# EasyEDA Pro project ProPrj_工创赛_2026-09-08.epro, schematic Schematic1

## Sheets
1 Power: Assembly Variant: Basic; Board Name: Board1; Create Date: 2026-08-24; Page Name: P1; Project Name: 工创赛; Schematic Name: Schematic1; Update Date: 2026-08-24; Company: 嘉立创EDA; Page Size: A4; Version: V1.0
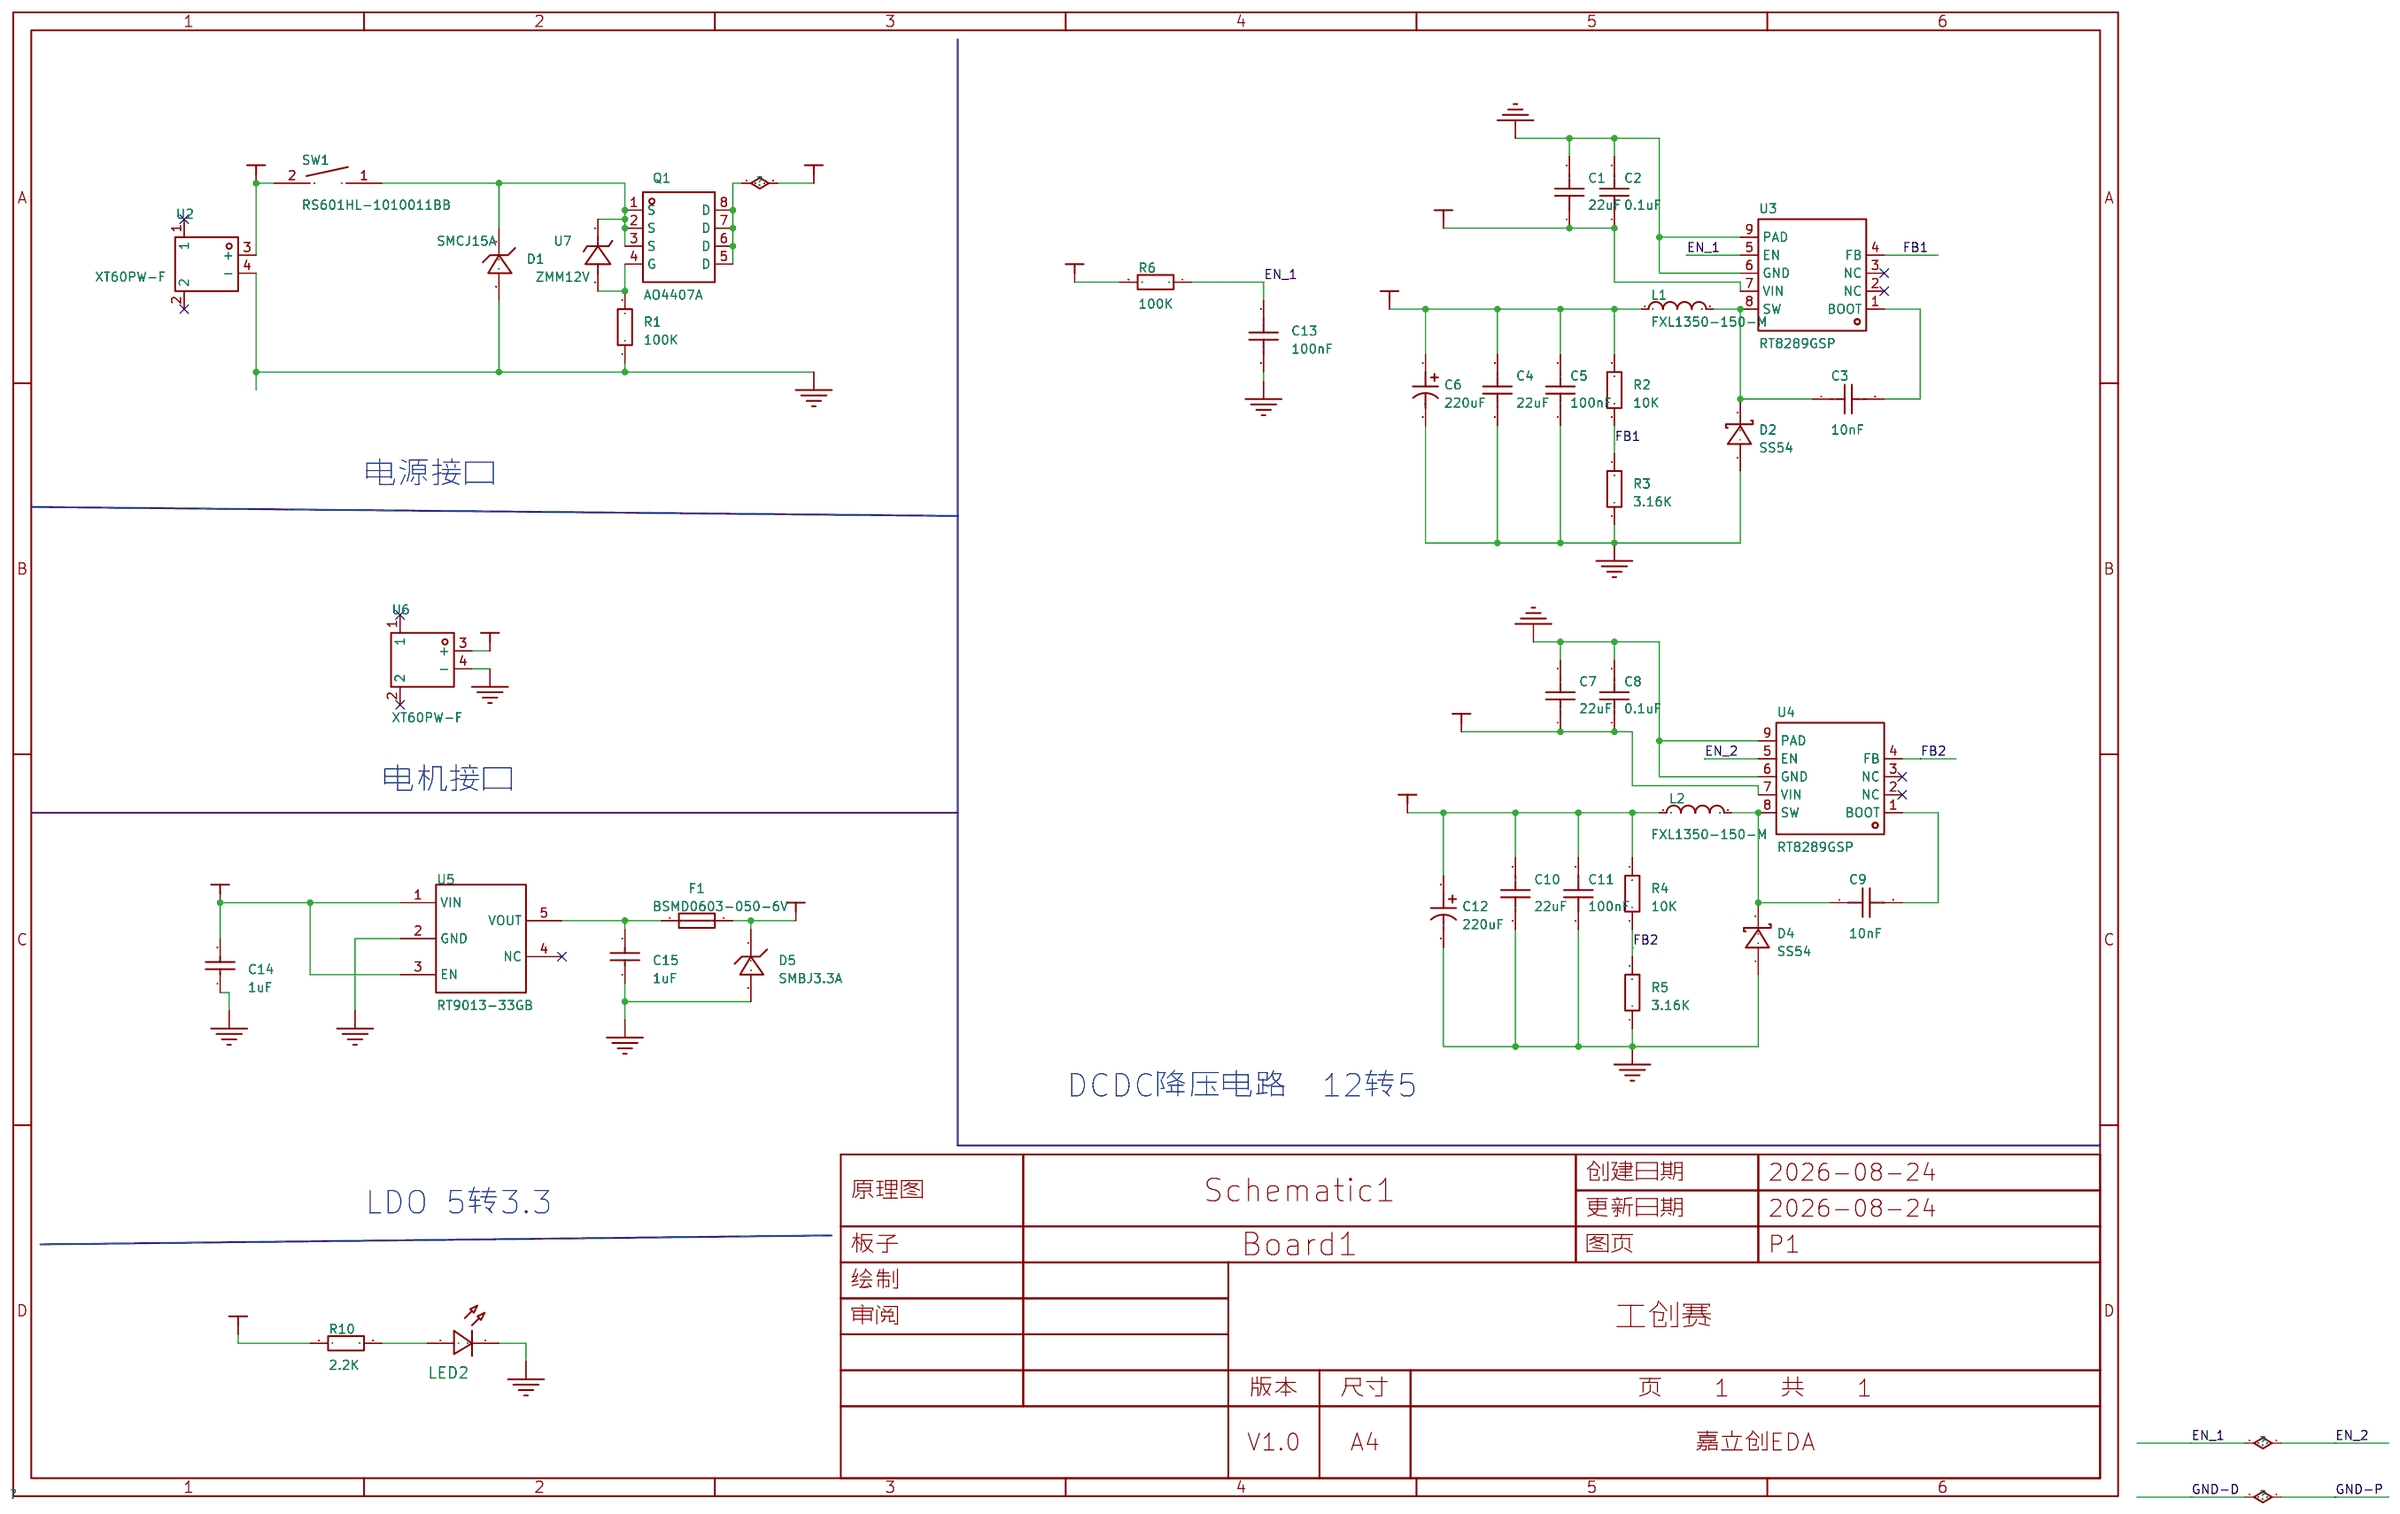
[diagram p0: Power]
2 MCU: Create Date: 2026-08-26; Update Date: 2026-08-26
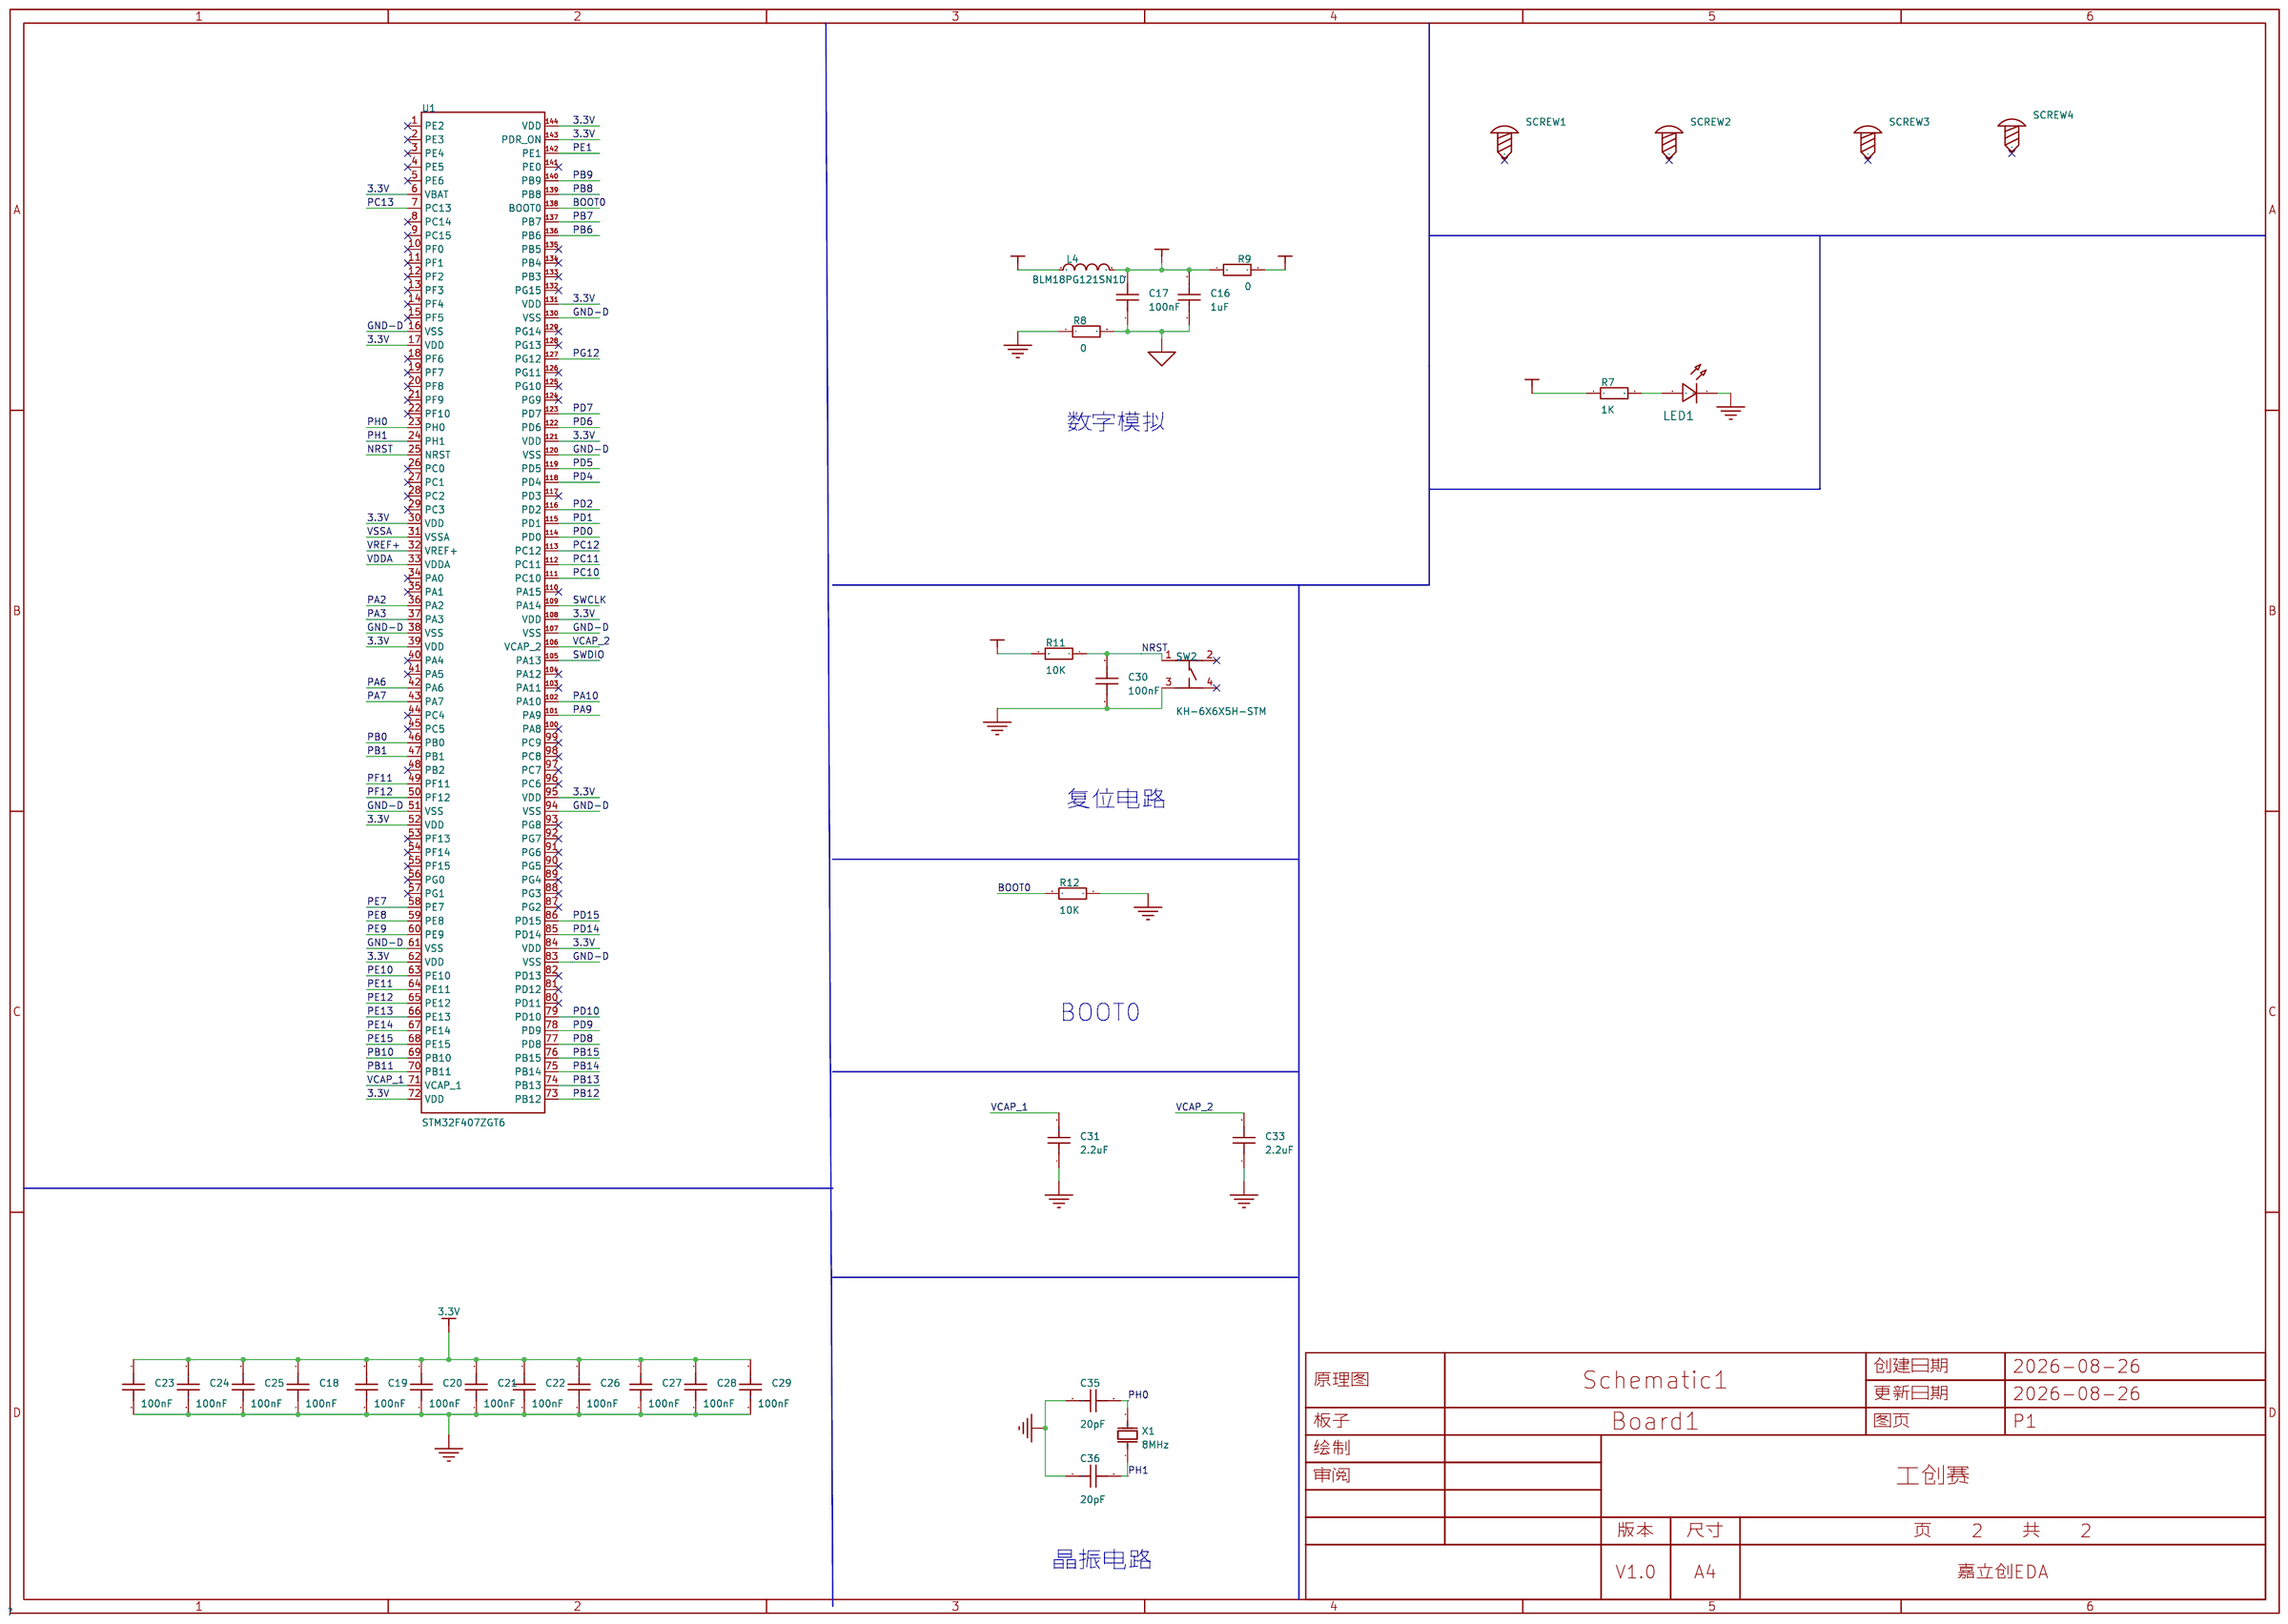
[diagram p1: MCU]
3 Single: Create Date: 2026-09-01; Update Date: 2026-09-01
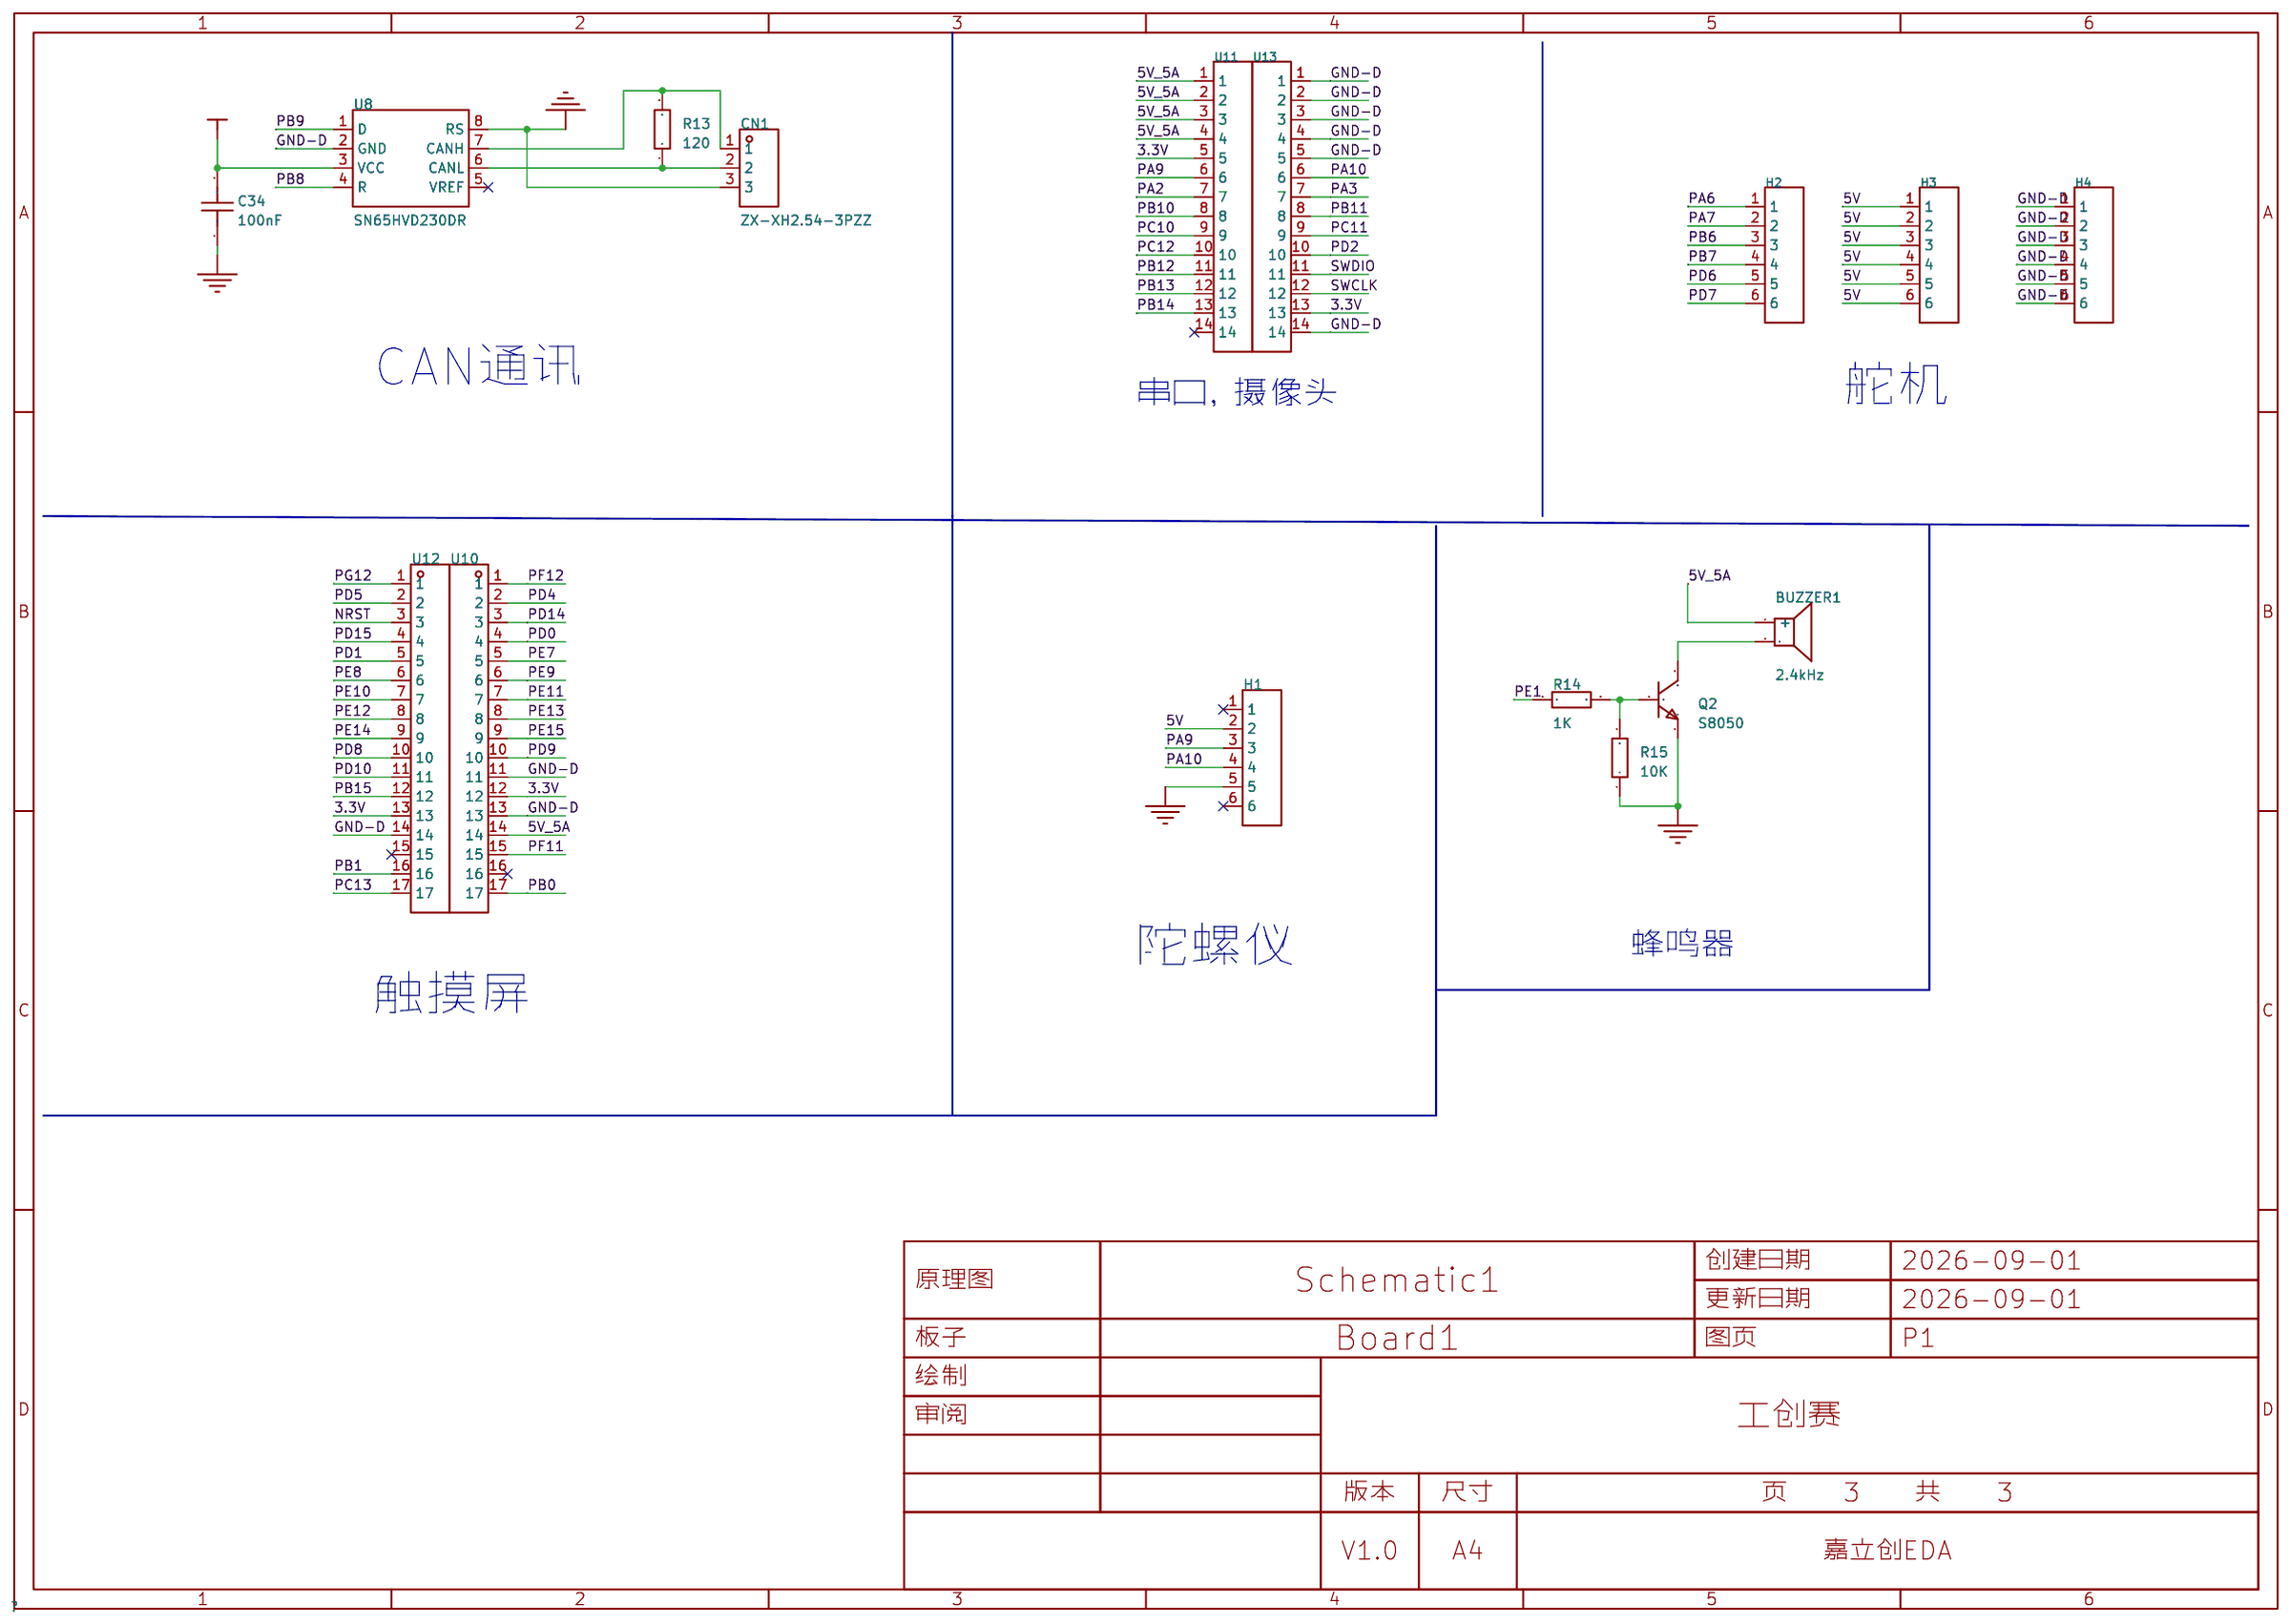
[diagram p2: Single]

## Parts
sheet MCU
C16  1uF  [C0603]
C17  100nF  [C0603]
C18  100nF  [C0603]
C19  100nF  [C0603]
C20  100nF  [C0603]
C21  100nF  [C0603]
C22  100nF  [C0603]
C23  100nF  [C0603]
C24  100nF  [C0603]
C25  100nF  [C0603]
C26  100nF  [C0603]
C27  100nF  [C0603]
C28  100nF  [C0603]
C29  100nF  [C0603]
C30  100nF  [C0603]
C31  2.2uF  [C0603]
C33  2.2uF  [C0603]
C35  20pF  [C0603]
C36  20pF  [C0603]
L4  BLM18PG121SN1D  [L0603]
LED1  -  [LED_0603]
R7  1K  [R0603]
R8  0  [R0603]
R9  0  [R0603]
R11  10K  [R0603]
R12  10K  [R0603]
SCREW1  -  [M3螺丝]
SCREW2  -  [M3螺丝]
SCREW3  -  [M3螺丝]
SCREW4  -  [M3螺丝]
SW2  KH-6X6X5H-STM  [SW-SMD_4P-L6.0-W6.0-P4.50-LS9.0_H5.0]
U1  STM32F407ZGT6  [LQFP-144_L20.0-W20.0-P0.50-LS22.0-BL]
X1  8MHz  [OSC-SMD_L5.0-W3.2]
sheet Power
C1  22uF  [C0603]
C2  0.1uF  [C0603]
C3  10nF  [C0603]
C4  22uF  [C0603]
C5  100nF  [C0603]
C6  220uF  [CAP-SMD_BD6.3-L6.6-W6.6-FD]
C7  22uF  [C0603]
C8  0.1uF  [C0603]
C9  10nF  [C0603]
C10  22uF  [C0603]
C11  100nF  [C0603]
C12  220uF  [CAP-SMD_BD6.3-L6.6-W6.6-FD]
C13  100nF  [C0603]
C14  1uF  [C0603]
C15  1uF  [C0603]
D1  SMCJ15A  [SMC_L6.9-W5.9-LS8.0-RD]
D2  SS54  [SMA_L4.4-W2.8-LS5.4-R-RD]
D4  SS54  [SMA_L4.4-W2.8-LS5.4-R-RD]
D5  SMBJ3.3A  [SMB_L4.6-W3.6-LS5.3-RD]
F1  BSMD0603-050-6V  [F0603]
L1  FXL1350-150-M  [IND-SMD_L12.6-W13.5]
L2  FXL1350-150-M  [IND-SMD_L12.6-W13.5]
LED2  -  [LED_0603]
Q1  AO4407A  [SOP-8_L5.0-W4.0-P1.27-LS6.0-BL]
R1  100K  [R0603]
R2  10K  [R0603]
R3  3.16K  [R0603]
R4  10K  [R0603]
R5  3.16K  [R0603]
R6  100K  [R0603]
R10  2.2K  [R0603]
SW1  RS601HL-1010011BB  [SW-TH_RS601HL-1010011BB]
U2  XT60PW-F  [TH_2P-XT60PW-F]
U3  RT8289GSP  [SOIC-8_L5.0-W4.0-P1.27-LS6.0-BL-EP2.0]
U4  RT8289GSP  [SOIC-8_L5.0-W4.0-P1.27-LS6.0-BL-EP2.0]
U5  RT9013-33GB  [SOT-23-5_L3.0-W1.7-P0.95-LS2.8-BL]
U6  XT60PW-F  [TH_2P-XT60PW-F]
U7  ZMM12V  [LL-34_L3.5-W1.5-RD-2]
sheet Single
BUZZER1  2.4kHz  [BUZ-TH_BD12.0-P7.60-D0.6-FD]
C34  100nF  [C0603]
CN1  ZX-XH2.54-3PZZ  [CONN-TH_3P-P2.54_2501S-3P]
H1  陀螺仪  [HDR-TH_PZ2.54-1X6PZZ-L11.5]
H2  LAIL-PZ2.54-6P-L  [CONN-TH_LAIL-PZ2.54-6P-L]
H3  LAIL-PZ2.54-6P-L  [CONN-TH_LAIL-PZ2.54-6P-L]
H4  LAIL-PZ2.54-6P-L  [CONN-TH_LAIL-PZ2.54-6P-L]
Q2  S8050  [SOT-23-3_L2.9-W1.3-P1.90-LS2.3-BR]
R13  120  [R0603]
R14  1K  [R0603]
R15  10K  [R0603]
U8  SN65HVD230DR  [SOIC-8_L4.9-W3.9-P1.27-LS6.0-BL]
U10  PM254-1-17-Z-8.5  [HDR-TH_17P-P2.54-V-F]
U11  LAIL-PM2.54-14P-L  [HDR-TH_LAIL-PM2.54-14P-L]
U12  触摸屏  [HDR-TH_17P-P2.54-V-F]
U13  LAIL-PM2.54-14P-L  [HDR-TH_LAIL-PM2.54-14P-L]

## Library data of the parts
C1-C5 C7-C11 C13 C16 C17 C30 C31 C33-C36 = CAP_0603: Supplier Footprint: 0603
C18-C29 = CC0603KRX7R9BB104: 容值:100nF;精度:±10%;额定电压:50V;材质(温度系数):X7R;; LCSC Part Name: 100nF ±10% 50V; Supplier Part: C14663; Manufacturer: YAGEO(国巨); Supplier Footprint: 0603; JLCPCB Part Class: 基础库; Datasheet: https://atta.szlcsc.com/upload/public/pdf/source/20180910/C282072_33301C7F631E79921B82A8DAC6BCC5B3.pdf; Supplier: LCSC; Tolerance: ±10%; Voltage Rated: 50V; Temperature Coefficient: X7R
L4 = BLM18PG121SN1D: 阻抗@频率:120Ω@100MHz;误差:±25%;直流电阻(DCR):50mΩ;; LCSC Part Name: 单路 0603磁珠 阻抗120Ω@100MHz; Supplier Part: C14709; Manufacturer: muRata(村田); Supplier Footprint: 0603; JLCPCB Part Class: Basic Part; Datasheet: https://item.szlcsc.com/datasheet/BLM18PG121SN1D/15379.html; Supplier: LCSC; Impedance @ Frequency: 120Ω@100MHz; Tolerance: ±25%; DC Resistance(DCR): 50mΩ; Current Rating: 2A; Number of Circuits: 1; Operating Temperature: -55℃~+125℃
LED1 LED2 = LED_0603-R: Supplier Footprint: 0603
R1-R15 = Res_0603: Supplier Footprint: 0603
SCREW1-SCREW4 = M3螺丝: Supplier Footprint: 插件
SW2 = KH-6X6X5H-STM: 电路结构:单刀单掷;按钮形状:圆形按钮;安装方式:立贴;开关长度:6mm;开关宽度:6mm;开关高度:5mm;带支架:不带支架;触点电流:50mA;额定电压:12V;工作寿命:8万次;; LCSC Part Name: 6*6*5mm 立贴 轻触开关; Supplier Part: C2837531; Manufacturer: kinghelm(金航标); Supplier Footprint: SMD-4P,6x6mm; JLCPCB Part Class: Extended Part; Datasheet: https://item.szlcsc.com/datasheet/KH-6X6X5H-STM/3009601.html; Supplier: LCSC; Circuit: 单刀单掷; Actuator Style: 圆形按钮; Mounting Type: 立贴; Length: 6mm; Width: 6mm; Switch Height: 5mm; with Bracket: 不带支架; Contact Current: 50mA; Voltage Rating: 12V; Actuator/Cap Color: 黑色; Termination Style: 鸥翼型; Life: 8万次
U1 = STM32F407ZGT6: CPU内核:ARM Cortex-M4;CPU最大主频:168MHz;CPU位数:32 Bit;; LCSC Part Name: 带DSP和FPU的高性能基础系列ARM Cortex-M4 MCU，具有1 MB Flash、168 MHz CPU、ART加速器、以太网和FSMC; Supplier Part: C19156; Manufacturer: ST(意法半导体); Supplier Footprint: LQFP-144(20x20); JLCPCB Part Class: Extended Part; Datasheet: https://item.szlcsc.com/datasheet/STM32F407ZGT6/19860.html; Supplier: LCSC; CPU Core: ARM Cortex-M4; CPU Maximum Speed: 168MHz; Core Size: 32 Bit; Program Storage Size: 1MB; Program Memory Type: FLASH; RAM Size: 192KB; Number of I/O: 114; ADC (Bit): 12bit; DAC (Bit): 12bit; Oscillator Type: 内置; Voltage - Supply: 1.8V~3.6V; Operating Temperature: -40℃~+85℃
X1 = TAXM8M2QLFCDT1T: 晶振类型:贴片晶振;频率:8MHz;常温频差:±30ppm;负载电容:20pF;频率稳定度:±20ppm;; LCSC Part Name: 8MHz ±30ppm 20pF; Supplier Part: C122522; Manufacturer: YJX(雅晶鑫); Supplier Footprint: SMD5032-2P; JLCPCB Part Class: Extended Part; Datasheet: https://item.szlcsc.com/datasheet/TAXM8M2QLFCDT1T/123791.html; Supplier: LCSC; Type: 贴片晶振; Normal temperature Frequency Tolerance: ±30ppm; Load Capacitance: 20pF; Frequency Stability: ±20ppm; Equivalent Series Resistance(ESR): 80Ω; Operating Temperature: -40℃~+85℃
C6 C12 = RVT220UF16V67RV0015: 容值:220uF;精度:±20%;额定电压:16V;纹波电流:110mA@120Hz;等效串联电阻(ESR):-;; LCSC Part Name: 220uF ±20% 16V; Supplier Part: C2887273; Manufacturer: KNSCHA(科尼盛); Supplier Footprint: SMD,D6.3xL7.7mm; JLCPCB Part Class: Extended Part; Datasheet: https://item.szlcsc.com/datasheet/RVT220UF16V67RV0015/3103841.html; Supplier: LCSC; Tolerance: ±20%; Voltage Rating: 16V; Ripple Current: 110mA@120Hz; Diameter: 6.3mm; Height - Seated (Max): 7.7mm; Lifetime: 2000hrs@105℃; Operating Temperature: -55℃~+105℃
C14 C15 = CC0603KRX7R7BB105: 容值:1uF;精度:±10%;额定电压:16V;温度系数:X7R;; LCSC Part Name: 1uF ±10% 16V; Supplier Part: C106248; Manufacturer: YAGEO(国巨); Supplier Footprint: 0603; JLCPCB Part Class: Extended Part; Datasheet: https://item.szlcsc.com/datasheet/CC0603KRX7R7BB105/107463.html; Supplier: LCSC; Tolerance: ±10%; Voltage Rating: 16V; Temperature Coefficient: X7R
D1 = SMCJ15A_C42371550: 极性:单向;反向截止电压(Vrwm):15V;钳位电压:24.4V;峰值脉冲电流(Ipp):61.5A;峰值脉冲功率(Ppp):1.5kW;击穿电压(VBR):18.5V;; LCSC Part Name: 单向TVS 15V截止 峰值浪涌电流：61.5A; Supplier Part: C42371550; Manufacturer: R+O(宏嘉诚); Supplier Footprint: SMC(DO-214AB); JLCPCB Part Class: Extended Part; Datasheet: https://item.szlcsc.com/datasheet/SMCJ15A/44252477.html; Supplier: LCSC; Polarity: 单向; Reverse Stand-Off Voltage (Vrwm): 15V; Clamping Voltage: 24.4V; Peak Pulse Current (Ipp): 61.5A; Peak Pulse Power Dissipation (Ppp): 1.5kW; Voltage - Breakdown: 18.5V; Reverse Leakage Current (Ir): 1uA; Operating Temperature: -55℃~+150℃; level of protection: IEC 61000-4-2; Type: TVS
D2 D4 = SS54_C22452: 二极管配置:独立式;正向压降(Vf):550mV@5A;直流反向耐压(Vr):40V;整流电流:5A;; LCSC Part Name: 电压:40V 电流:5A; Supplier Part: C22452; Manufacturer: MDD(辰达半导体); Supplier Footprint: SMA(DO-214AC); JLCPCB Part Class: Basic Part; Datasheet: https://item.szlcsc.com/datasheet/SS54/23178.html; Supplier: LCSC; Diode Configuration: 独立式; Voltage - Forward(Vf@If): 550mV@5A; Voltage - DC Reverse(Vr): 40V; Current - Rectified: 5A; Reverse Leakage Current (Ir): 1mA@40V; Operating Junction Temperature Range: -55℃~+125℃
D5 = SMBJ3.3A_C19077556: 极性:单向;反向截止电压(Vrwm):3.3V;钳位电压:8V;峰值脉冲电流(Ipp):75A@10/1000us;峰值脉冲功率(Ppp):600W@10/1000us;击穿电压:6.5V;; LCSC Part Name: 单向TVS 3.3V截止 峰值浪涌电流：75A@10/1000us; Supplier Part: C19077556; Manufacturer: R+O(宏嘉诚); Supplier Footprint: DO-214AA(SMB); JLCPCB Part Class: Extended Part; Datasheet: https://item.szlcsc.com/datasheet/SMBJ3.3A/20275641.html; Supplier: LCSC; Polarity: 单向; Reverse Stand-Off Voltage (Vrwm): 3.3V; Clamping Voltage: 8V; Peak Pulse Current (Ipp): 75A@10/1000us; Peak Pulse Power Dissipation (Ppp): 600W@10/1000us; Voltage - Breakdown: 6.5V; Reverse Leakage Current (Ir): 600uA; Operating Temperature: -55℃~+150℃; level of protection: IEC 61000-4-2; Type: TVS
F1 = BSMD0603-050-6V: 耐压(Vmax):6V;最大电流(Imax):40A;保持电流(Ihold):500mA;跳闸电流(Itrip):1A;; LCSC Part Name: 6V 500mA 0603自恢复; Supplier Part: C883095; Manufacturer: BHFUSE(佰宏); Supplier Footprint: 0603; JLCPCB Part Class: Extended Part; Datasheet: https://item.szlcsc.com/datasheet/BSMD0603-050-6V/947770.html; Supplier: LCSC; Voltage - Max: 6V; Current - Max: 40A; Hold Current: 500mA; Trip Current: 1A; Power Dissipation: 500mW; Resistance - Initial (Ri) (Min): 100mΩ; Resistance - Post Trip (R1) (Max): 800mΩ; Time to Trip(Max): 100ms; Operating Temperature: -40℃~+85℃; Length: 1.85mm; Width: 1.05mm; Height: 1.15mm
L1 L2 = FXL1350-150-M: 温升电流（irms）：8A  SMD,13.45x12.6x4.8mm; LCSC Part Name: 15uH ±20% 10A; Supplier Part: C7471125; Manufacturer: cjiang(长江微电); Supplier Footprint: SMD,13.5x12.6mm; JLCPCB Part Class: Extended Part; Datasheet: https://item.szlcsc.com/datasheet/FXL1350-150-M/8524279.html; Supplier: LCSC
Q1 = AO4407A_C2841482: 数量:1个P沟道;漏源电压(Vdss):30V;连续漏极电流(Id):14A;导通电阻(RDS(on)):9.5mΩ@10V；14.7mΩ@4.5V;耗散功率(Pd):3.1W;阈值电压(Vgs(th)):1.8V@250uA;; LCSC Part Name: 1个P沟道 耐压:30V 电流:14A; Supplier Part: C2841482; Manufacturer: UMW(友台半导体); Supplier Footprint: SOP-8; JLCPCB Part Class: Extended Part; Datasheet: https://item.szlcsc.com/datasheet/AO4407A/3024118.html; Supplier: LCSC; Number: 1个P沟道; Drain to Source Voltage: 30V; Current - Continuous Drain(Id): 14A; RDS(on): 9.5mΩ@10V；14.7mΩ@4.5V; Pd - Power Dissipation: 3.1W; Gate Threshold Voltage (Vgs(th)): 1.8V@250uA; Gate Charge(Qg): 40nC@10V；20nC@4.5V; Input Capacitance(Ciss): 2.05nF; Reverse Transfer Capacitance (Crss@Vds): 300pF; Operating Temperature: -55℃~+150℃; Output Capacitance(Coss): 330pF
SW1 = RS601HL-1010011BB: 带灯:无;引脚样式:焊片;额定电流:3A;额定电压(AC):250V;额定电压(DC):-;电路结构:单刀单掷;工作寿命:1万次;; Supplier Part: C2885782; Manufacturer: HCTL(华灿天禄); Supplier Footprint: 插件,15x10.5mm; JLCPCB Part Class: Extended Part; Datasheet: https://item.szlcsc.com/datasheet/RS601HL-1010011BB/3096684.html; Supplier: LCSC; Length: 15mm; Width: 10.5mm; Actuator Type: 凹面弯曲; With Lamp: 无; Termination Style: 焊片; Actuator Color: 黑色; Current Rating: 3A; Voltage Rating (AC): 250V; Circuit: 单刀单掷; Life: 1万次; Operating Temperature: -25℃~+85℃; Actuator Identifier: - O
U2 U6 = XT60PW-F: LCSC Part Name: AMASS(艾迈斯)插头锂电池组充电接头 线到板连接器大电流30A连接器 航模电调卧式焊板 母头XT60PW-F.G.Y; Supplier Part: C428722; Manufacturer: AMASS(艾迈斯); JLCPCB Part Class: Extended Part; Datasheet: https://item.szlcsc.com/datasheet/XT60PW-F/423834.html; Supplier: LCSC; colour: 黄色; Connector type: 卧式插头; interface form: 母头
U3 U4 = RT8289GSP: 功能类型:降压型;工作电压:5.5V~32V;输出电压:1.222V~26V;输出电流:5A;输出类型:可调;; LCSC Part Name: 降压型 5A 5.5V~32V; Supplier Part: C39202; Manufacturer: RICHTEK(立锜); Supplier Footprint: SOIC-8-EP; JLCPCB Part Class: Extended Part; Datasheet: https://item.szlcsc.com/datasheet/RT8289GSP/40185.html; Supplier: LCSC; Function: 降压型; Voltage - Supply: 5.5V~32V; Output Voltage: 1.222V~26V; Output Current: 5A; Frequency - Switching: 500kHz; Operating Temperature: -40℃~+125℃; Synchronous Rectifier: 否; Number of Outputs: 1; Topology: 降压式; Quiescent Current: 25uA; Switch tube (built-in/external): 内置; Output Type: 可调; Features: 逐波限流；过流保护
U5 = RT9013-33GB: 输出极性:正极;工作电压:5.5V;输出电压:3.3V;输出电流:500mA;电源纹波抑制比(PSRR):50dB@(10kHz);输出类型:固定;; LCSC Part Name: 3.3V 500mA 5.5V; Supplier Part: C47773; Manufacturer: RICHTEK(立锜); Supplier Footprint: SOT-23-5; JLCPCB Part Class: Extended Part; Datasheet: https://item.szlcsc.com/datasheet/RT9013-33GB/48778.html; Supplier: LCSC; Output Configuration: 正极; Voltage - Supply: 5.5V; Output Voltage: 3.3V; Output Current: 500mA; Power Supply Rejection Ratio (PSRR): 50dB@(10kHz); Voltage Dropout: 400mV@(500mA); standby current: 25uA; Noise: 30uVrms; Features: 使能控制；短路保护；过流保护；热关断; Operating Temperature: -40℃~+125℃@(Tj); Output Type: 固定; Number of Outputs: 1
U7 = ZMM12V_C5345999: 二极管配置:1个独立式;稳压值(标称值):12V;稳压值(范围):11.4V~12.7V;耗散功率(Pd):500mW;; LCSC Part Name: 独立式 耐压:12V 电流:0.1uA@9.1V; Supplier Part: C5345999; Manufacturer: HXY MOSFET(华轩阳电子); Supplier Footprint: LL-34; JLCPCB Part Class: Extended Part; Datasheet: https://item.szlcsc.com/datasheet/ZMM12V/6125836.html; Supplier: LCSC; Diode Configuration: 1个独立式; Zener Voltage(Nom): 12V; Reverse Leakage Current (Ir): 100nA@9.1V; Zener Voltage(Range): 11.4V~12.7V; Pd - Power Dissipation: 500mW; Impedance(Zzt): 20Ω; Impedance(Zzk): 90Ω
BUZZER1 = TMB12A05_C96093: 驱动方式:有源(内含驱动线路);构造类型:电磁式;额定电压:5V;频率:2.4kHz;声压(SPL):85dB;; LCSC Part Name: 有源(内含驱动线路) 电磁式 2.4kHz; Supplier Part: C96093; Manufacturer: 华能; Manufacturer Part: TMB12A05; Supplier Footprint: 插件,D=12mm; JLCPCB Part Class: Extended Part; Datasheet: https://item.szlcsc.com/datasheet/TMB12A05/97297.html; Supplier: LCSC; Driver Circuitry: 有源(内含驱动线路); Technology: 电磁式; Voltage Rating: 5V; Voltage - Supply: 4V~8V; Current Consumption: 30mA; Sound Pressure Level(SPL): 85dB; Diameter(φD): 12mm; Height: 9.8mm; Operating Temperature: -40℃~+85℃; Mounting Type: 插件
CN1 = ZX-XH2.54-3PZZ: 插针结构:1x3P;间距:2.5mm;安装方式:直插;参考系列:XH;总PIN数:3P;排数:1;每排PIN数:3;行距:-;额定电流:3A;触头材质:黄铜;触头镀层:锡;工作温度:-25℃~+85℃;; LCSC Part Name: 1x3P 间距:2.5mm 直插 系列:XH; Supplier Part: C7429633; Manufacturer: Megastar(兆星); Supplier Footprint: 插件,P=2.5mm; JLCPCB Part Class: Extended Part; Datasheet: https://item.szlcsc.com/datasheet/ZX-XH2.54-3PZZ/8427550.html; Supplier: LCSC; Pins Structure: 1x3P; Pitch: 2.5mm; Mounting Type: 直插; Reference Series: XH; Number of Pins: 3P; Number of Rows: 1; Number of PINs Per Row: 3; Current Rating: 3A; Contact Material: 黄铜; Contact Plating: 锡; Operating Temperature: -25℃~+85℃; Voltage Rating: 250V; Plastic Material: PA66; Flame Retardant Rating: UL94V-0; Color: 白色; Z-Height of the Board: 7mm; X-Length of Bottom Edge on Board (Spacing Line): 10mm; Y-Width of Bottom Edge on Board: 5.9mm
H1 = PZ2.54-1x6PZZ-L11.5: 插针结构:1x6P;间距:2.54mm;行距:-;圆针/方针:方针;安装方式:直插;排数:单排;总PIN位数:6P;额定电流:3A;额定电压:250V;配合针长度:6mm;塑高:2.5mm;端接针长度:3mm;触头材质:黄铜;触头镀层:金;工作温度:-40℃~+105℃;颜色:黑色;; LCSC Part Name: 1x6P 间距:2.54mm 方针 直插; Supplier Part: C54876671; Manufacturer: SHOU HAN(首韩); Supplier Footprint: 插件,P=2.54mm; JLCPCB Part Class: Extended Part; Datasheet: https://item.szlcsc.com/datasheet/PZ2.54-1x6PZZ-L11.5/58389786.html; Supplier: LCSC; Pin Structure: 1x6P; Pitch: 2.54mm; Circluar Pins/Square Pins: 方针; Mounting Type: 直插; Number of Rows: 单排; Number of Pins: 6P; Current Rating: 3A; Voltage Rating (Max): 250V; Length of Mating Pin: 6mm; Insulation Height: 2.5mm; Length of End Connection Pin: 3mm; Contact Material: 黄铜; Contact Plating: 金; Operating Temperature: -40℃~+105℃; Color: 黑色
H2-H4 = LAIL-PZ2.54-6P-L: 插针结构:1x6P;间距:2.54mm;圆针/方针:方针;排数:单排;总PIN位数:6P;额定电流:3A;额定电压:250V;塑高:2.5mm;端接针长度:3mm;触头材质:黄铜;触头镀层:金;工作温度:-25℃~+80℃;颜色:黑色;; LCSC Part Name: 1x6P 间距:2.54mm 方针; Supplier Part: C54950607; Manufacturer: LAILAN(莱联); Supplier Footprint: 插件,P=2.54mm; JLCPCB Part Class: Extended Part; Datasheet: https://item.szlcsc.com/datasheet/LAIL-PZ2.54-6P-L/58519960.html; Supplier: LCSC; Pin Structure: 1x6P; Pitch: 2.54mm; Circluar Pins/Square Pins: 方针; Number of Rows: 单排; Number of Pins: 6P; Current Rating: 3A; Voltage Rating (Max): 250V; Insulation Height: 2.5mm; Length of End Connection Pin: 3mm; Contact Material: 黄铜; Contact Plating: 金; Operating Temperature: -25℃~+80℃; Color: 黑色
Q2 = S8050_C20069125: 晶体管类型:NPN;集电极电流(Ic):500mA;集射极击穿电压(Vceo):25V;耗散功率(Pd):300mW;直流电流增益(hFE):120;; LCSC Part Name: hFE:200-350，丝印:J3Y NPN 500mA 25V; Supplier Part: C20069125; Manufacturer: R+O(宏嘉诚); Supplier Footprint: SOT-23; JLCPCB Part Class: Extended Part; Datasheet: https://item.szlcsc.com/datasheet/S8050/21397163.html; Supplier: LCSC; type: NPN; Current - Collector(Ic): 500mA; Collector - Emitter Voltage VCEO: 25V; Pd - Power Dissipation: 300mW; DC Current Gain: 120; Transition frequency(fT): 100MHz; Current - Collector Cutoff: 100nA; Vce Saturation(VCE(sat)): 600mV; Operating Temperature: -55℃~+150℃; Emitter-Base Voltage(Vebo): 5V; Number: 1个NPN; Configuration: 独立式
U8 = SN65HVD230DR: 类型:CAN收发器;数据速率:1Mbps;; LCSC Part Name: 3.3-V CAN 收发器; Supplier Part: C12084; Manufacturer: TI(德州仪器); Supplier Footprint: SOIC-8; JLCPCB Part Class: Extended Part; Datasheet: https://www.ti.com/cn/lit/ds/symlink/sn65hvd230.pdf; Supplier: LCSC; Type: CAN收发器; Data Rate: 1Mbps; Voltage - Supply: 3V~3.6V; Current - Supply: 17mA; Operating Temperature: -40℃~+85℃; Number of Channels: 1; Quiescent Supply Current: 370uA; Features: 唤醒功能；热插拔保护；热关断保护；ESD保护；低功耗模式；总线故障保护
U10 U12 = PM254-1-17-Z-8.5: 插孔结构:1x17P;间距:2.54mm;行距:-;圆孔/方孔:方孔;安装方式:直插;排数:单排;总孔位数:17P;额定电流:3A;额定电压:-;插孔方向:顶部;塑高:8.5mm;触头材质:铜合金;工作温度:-40℃~+105℃;; LCSC Part Name: 1x17P 间距:2.54mm 直插; Supplier Part: C2897380; Manufacturer: HCTL(华灿天禄); Supplier Footprint: 插件,P=2.54mm; JLCPCB Part Class: Extended Part; Datasheet: https://item.szlcsc.com/datasheet/PM254-1-17-Z-8.5/3142385.html; Supplier: LCSC; Holes Structure: 1x17P; Pitch: 2.54mm; Circular Hole / Square Hole: 方孔; Mounting Type: 直插; Number of Rows: 单排; Number of Positions: 17P; Current Rating: 3A; Holes Direction: 顶部; Insulation Height: 8.5mm; Contact Material: 铜合金; Operating Temperature: -40℃~+105℃
U11 U13 = LAIL-PM2.54-14P-L: 插孔结构:1x14P;间距:2.54mm;圆孔/方孔:方孔;安装方式:直插;排数:单排;总孔位数:14P;额定电流:3A;额定电压:250V;插孔方向:顶部;塑高:8.5mm;触头材质:黄铜;触头镀层:金;工作温度:-25℃~+80℃;; LCSC Part Name: 1x14P 间距:2.54mm 直插; Supplier Part: C54973850; Manufacturer: 莱联; Supplier Footprint: 插件,P=2.54mm; JLCPCB Part Class: Extended Part; Datasheet: https://item.szlcsc.com/datasheet/LAIL-PM2.54-14P-L/58554928.html; Supplier: LCSC; Holes Structure: 1x14P; Pitch: 2.54mm; Circular Hole / Square Hole: 方孔; Mounting Type: 直插; Number of Rows: 单排; Number of Positions: 14P; Current Rating: 3A; Voltage Rating (Max): 250V; Holes Direction: 顶部; Insulation Height: 8.5mm; Contact Material: 黄铜; Contact Plating: 金; Operating Temperature: -25℃~+80℃; PIN Length: 3mm

## Nets
3.3V: C18.2 C19.2 C20.2 C21.2 C22.2 C23.2 C24.2 C25.2 C26.2 C27.2 C28.2 C29.2 C34.2 D5.1 F1.2 L4.1 R7.1 R11.2 U1.6(VBAT) U1.17(VDD) U1.30(VDD) U1.39(VDD) U1.52(VDD) U1.62(VDD) U1.72(VDD) U1.84(VDD) U1.95(VDD) U1.108(VDD) U1.121(VDD) U1.131(VDD) U1.143(PDR_ON) U1.144(VDD) U8.3(VCC) U10.12 U11.5 U12.13 U13.13
5V: C4.2 C5.2 C6.1 C14.2 H1.2 H3.1 H3.2 H3.3 H3.4 H3.5 H3.6 L1.1 R2.2 U5.1(VIN) U5.3(EN)
5V_5A: BUZZER1.1(+) C10.2 C11.2 C12.1 L2.1 R4.2 U10.14 U11.1 U11.2 U11.3 U11.4
GND-D: C1.2 C2.2 C4.1 C5.1 C6.2 C7.2 C8.2 C10.1 C11.1 C12.2 C13.2 C14.1 C15.1 C18.1 C19.1 C20.1 C21.1 C22.1 C23.1 C24.1 C25.1 C26.1 C27.1 C28.1 C29.1 C30.2 C31.1 C33.1 C34.1 C35.1 C36.1 CN1.3 D1.2 D2.1(A) D4.1(A) D5.2 H1.5 H4.1 H4.2 H4.3 H4.4 H4.5 H4.6 LED1.1(C) LED2.1(C) Q2.2(E) R1.1 R3.1 R5.1 R8.1 R12.1 R15.1 SW2.3 U1.16(VSS) U1.38(VSS) U1.51(VSS) U1.61(VSS) U1.83(VSS) U1.94(VSS) U1.107(VSS) U1.120(VSS) U1.130(VSS) U2.4(-) U3.6(GND) U3.9(PAD) U4.6(GND) U4.9(PAD) U5.2(GND) U6.4(-) U8.2(GND) U8.8(RS) U10.11 U10.13 U12.14 U13.1 U13.2 U13.3 U13.4 U13.5 U13.14
VDDA: C16.2 C17.2 L4.2 R9.1 U1.33(VDDA)
VIN-D: C1.1 C2.1 C7.1 C8.1 Q1.5(D) Q1.6(D) Q1.7(D) Q1.8(D) R6.2 R10.1 U3.7(VIN) U4.7(VIN)
VIN-P: SW1.2 U2.3(+) U6.3(+)
VSSA: C16.1 C17.1 R8.2 U1.31(VSSA)
BOOT0: R12.2 U1.138(BOOT0)
EN_1: C13.1 R6.1 U3.5(EN) U4.5(EN)
FB1: R2.1 R3.2 U3.4(FB)
FB2: R4.1 R5.2 U4.4(FB)
NRST: C30.1 R11.1 SW2.1 U1.25(NRST) U12.3
PA2: U1.36(PA2) U11.7
PA3: U1.37(PA3) U13.7
PA6: H2.1 U1.42(PA6)
PA7: H2.2 U1.43(PA7)
PA9: H1.3 U1.101(PA9) U11.6
PA10: H1.4 U1.102(PA10) U13.6
PB0: U1.46(PB0) U10.17
PB1: U1.47(PB1) U12.16
PB6: H2.3 U1.136(PB6)
PB7: H2.4 U1.137(PB7)
PB8: U1.139(PB8) U8.4(R)
PB9: U1.140(PB9) U8.1(D)
PB10: U1.69(PB10) U11.8
PB11: U1.70(PB11) U13.8
PB12: U1.73(PB12) U11.11
PB13: U1.74(PB13) U11.12
PB14: U1.75(PB14) U11.13
PB15: U1.76(PB15) U12.12
PC10: U1.111(PC10) U11.9
PC11: U1.112(PC11) U13.9
PC12: U1.113(PC12) U11.10
PC13: U1.7(PC13) U12.17
PD0: U1.114(PD0) U10.4
PD1: U1.115(PD1) U12.5
PD2: U1.116(PD2) U13.10
PD4: U1.118(PD4) U10.2
PD5: U1.119(PD5) U12.2
PD6: H2.5 U1.122(PD6)
PD7: H2.6 U1.123(PD7)
PD8: U1.77(PD8) U12.10
PD9: U1.78(PD9) U10.10
PD10: U1.79(PD10) U12.11
PD14: U1.85(PD14) U10.3
PD15: U1.86(PD15) U12.4
PE1: R14.1 U1.142(PE1)
PE7: U1.58(PE7) U10.5
PE8: U1.59(PE8) U12.6
PE9: U1.60(PE9) U10.6
PE10: U1.63(PE10) U12.7
PE11: U1.64(PE11) U10.7
PE12: U1.65(PE12) U12.8
PE13: U1.66(PE13) U10.8
PE14: U1.67(PE14) U12.9
PE15: U1.68(PE15) U10.9
PF11: U1.49(PF11) U10.15
PF12: U1.50(PF12) U10.1
PG12: U1.127(PG12) U12.1
PH0: C35.2 U1.23(PH0) X1.2(OSC2)
PH1: C36.2 U1.24(PH1) X1.1(OSC1)
SWCLK: U1.109(PA14) U13.12
SWDIO: U1.105(PA13) U13.11
VCAP_1: C31.2 U1.71(VCAP_1)
VCAP_2: C33.2 U1.106(VCAP_2)
VREF+: R9.2 U1.32(VREF+)
$1N16: Q1.4(G) R1.2 U7.2(A)
$1N19: C3.1 D2.2(K) L1.2 U3.8(SW)
$1N20: C3.2 U3.1(BOOT)
$1N35: C9.2 U4.1(BOOT)
$1N36: C9.1 D4.2(K) L2.2 U4.8(SW)
$1N46: C15.2 F1.1 U5.5(VOUT)
$1N53: LED2.2(A) R10.2
$1N60: D1.1 Q1.1(S) Q1.2(S) Q1.3(S) SW1.1 U7.1(K)
$2N213: LED1.2(A) R7.2
$4N2: CN1.1 R13.2 U8.7(CANH)
$4N10: CN1.2 R13.1 U8.6(CANL)
$4N201: BUZZER1.2 Q2.3(C)
$4N202: Q2.1(B) R14.2 R15.2

Not connected (* = marked no-connect by the designer): H1 1* 6*; SCREW1 1*; SCREW2 1*; SCREW3 1*; SCREW4 1*; SW2 2* 4*; U1 1(PE2)* 2(PE3)* 3(PE4)* 4(PE5)* 5(PE6)* 8(PC14)* 9(PC15)* 10(PF0)* 11(PF1)* 12(PF2)* 13(PF3)* 14(PF4)* 15(PF5)* 18(PF6)* 19(PF7)* 20(PF8)* 21(PF9)* 22(PF10)* 26(PC0)* 27(PC1)* 28(PC2)* 29(PC3)* 34(PA0)* 35(PA1)* 40(PA4)* 41(PA5)* 44(PC4)* 45(PC5)* 48(PB2)* 53(PF13)* 54(PF14)* 55(PF15)* 56(PG0)* 57(PG1)* 80(PD11)* 81(PD12)* 82(PD13)* 87(PG2)* 88(PG3)* 89(PG4)* 90(PG5)* 91(PG6)* 92(PG7)* 93(PG8)* 96(PC6)* 97(PC7)* 98(PC8)* 99(PC9)* 100(PA8)* 103(PA11)* 104(PA12)* 110(PA15)* 117(PD3)* 124(PG9)* 125(PG10)* 126(PG11)* 128(PG13)* 129(PG14)* 132(PG15)* 133(PB3)* 134(PB4)* 135(PB5)* 141(PE0)*; U2 1* 2*; U3 2(NC)* 3(NC)*; U4 2(NC)* 3(NC)*; U5 4(NC)*; U6 1* 2*; U8 5(VREF)*; U10 16*; U11 14*; U12 15*

## Notes on the sheets
sheet 1
- 电源接口
- 电机接口
- DCDC降压电路  12转5
- LDO 5转3.3
sheet 2
- 数字模拟
- 复位电路
- BOOT0
- 晶振电路
sheet 3
- CAN通讯
- 串口，摄像头
- 舵机
- 蜂鸣器
- 陀螺仪
- 触摸屏
